# Altium schematic sheet 13-AM64x-02.SchDoc
size B; SheetNumber: 13; SheetTotal: 25
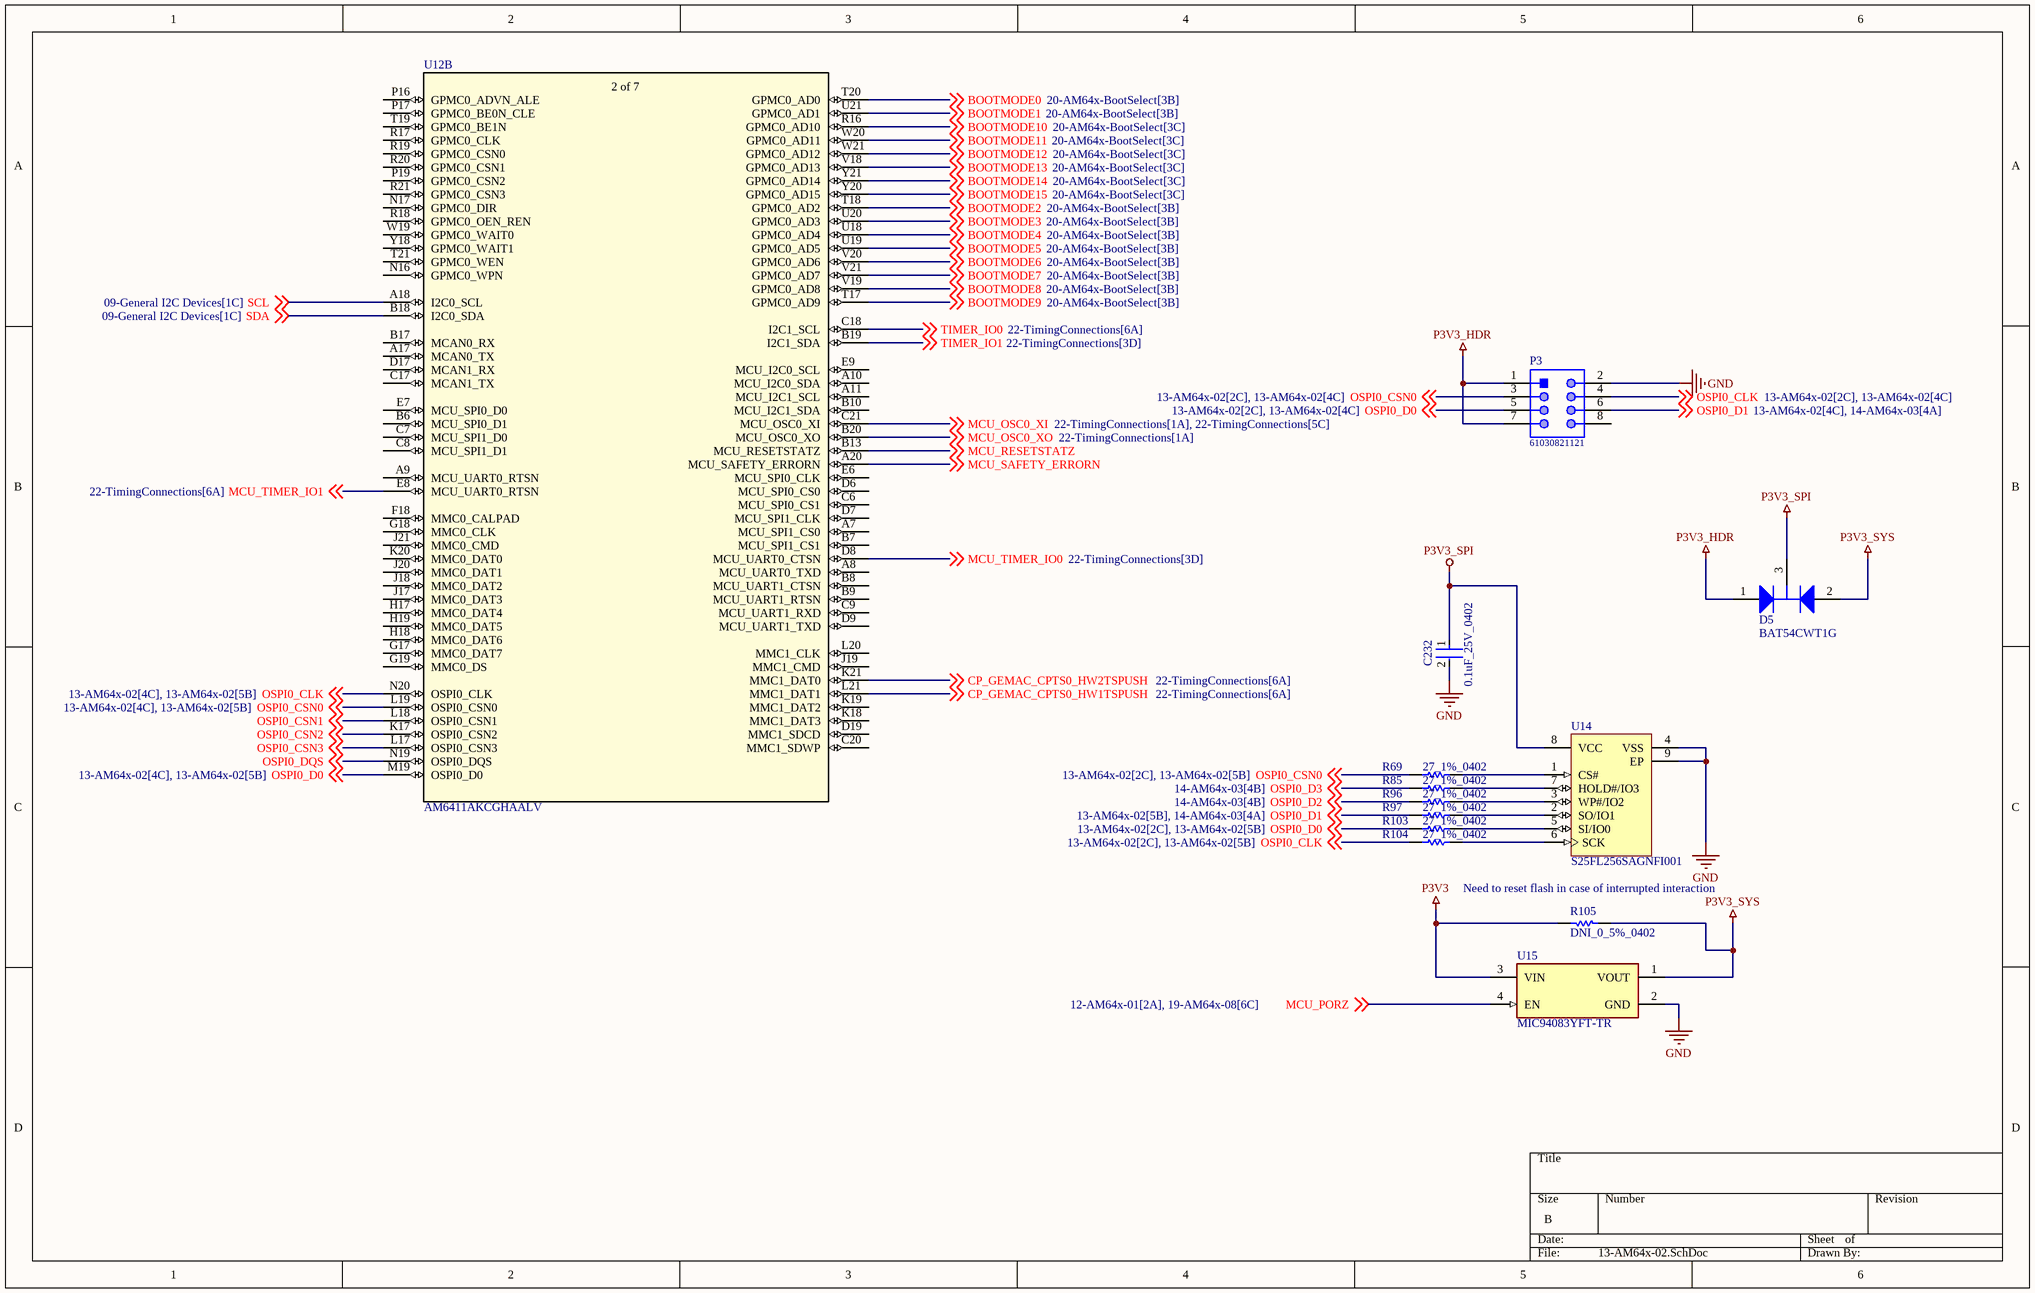
[diagram p0: 13-AM64x-02.SchDoc]

## Parts
C232  0.1uF_25V_0402  [FP-0402-L_1_0_1-W_0_5_0_1-IPC_C]
D5  BAT54CWT1G  [ONSC-SOT-323-3-419-04_V]
P3  61030821121  [61030821121]
R69  27_1%_0402  [RESC1005X40X25NL05T05]
R85  27_1%_0402  [RESC1005X40X25NL05T05]
R96  27_1%_0402  [RESC1005X40X25NL05T05]
R97  27_1%_0402  [RESC1005X40X25NL05T05]
R103  27_1%_0402  [RESC1005X40X25NL05T05]
R104  27_1%_0402  [RESC1005X40X25NL05T05]
R105  DNI_0_5%_0402  [RESC1005X40X25LL10T10]  (no BOM)
U12  AM6411AKCGHAALV  [FCBGA441_ALV_TEX]  (part B of 7)
U14  S25FL256SAGNFI001  [CYP-WSON-8_L]
U15  MIC94083YFT-TR  [FP-FTDFN085085-4LD-PL-1-MFG]

## Nets
GND: C232.2 P3.2 U14.4(VSS) U14.9(EP) U15.2(GND)
P3V3: R105.1 U15.3(VIN)
P3V3_HDR: D5.1(A1) P3.1 P3.7
P3V3_SPI: C232.1 D5.3(K) U14.8(VCC)
P3V3_SYS: D5.2(A2) R105.2 U15.1(VOUT)
BOOTMODE0: U12.T20(GPMC0_AD0) ; off-sheet BOOTMODE0
BOOTMODE1: U12.U21(GPMC0_AD1) ; off-sheet BOOTMODE1
BOOTMODE2: U12.T18(GPMC0_AD2) ; off-sheet BOOTMODE2
BOOTMODE3: U12.U20(GPMC0_AD3) ; off-sheet BOOTMODE3
BOOTMODE4: U12.U18(GPMC0_AD4) ; off-sheet BOOTMODE4
BOOTMODE5: U12.U19(GPMC0_AD5) ; off-sheet BOOTMODE5
BOOTMODE6: U12.V20(GPMC0_AD6) ; off-sheet BOOTMODE6
BOOTMODE7: U12.V21(GPMC0_AD7) ; off-sheet BOOTMODE7
BOOTMODE8: U12.V19(GPMC0_AD8) ; off-sheet BOOTMODE8
BOOTMODE9: U12.T17(GPMC0_AD9) ; off-sheet BOOTMODE9
BOOTMODE10: U12.R16(GPMC0_AD10) ; off-sheet BOOTMODE10
BOOTMODE11: U12.W20(GPMC0_AD11) ; off-sheet BOOTMODE11
BOOTMODE12: U12.W21(GPMC0_AD12) ; off-sheet BOOTMODE12
BOOTMODE13: U12.V18(GPMC0_AD13) ; off-sheet BOOTMODE13
BOOTMODE14: U12.Y21(GPMC0_AD14) ; off-sheet BOOTMODE14
BOOTMODE15: U12.Y20(GPMC0_AD15) ; off-sheet BOOTMODE15
CP_GEMAC_CPTS0_HW1TSPUSH: U12.L21(MMC1_DAT1) ; off-sheet CP_GEMAC_CPTS0_HW1TSPUSH
CP_GEMAC_CPTS0_HW2TSPUSH: U12.K21(MMC1_DAT0) ; off-sheet CP_GEMAC_CPTS0_HW2TSPUSH
MCU_OSC0_XI: U12.C21(MCU_OSC0_XI) ; off-sheet MCU_OSC0_XI
MCU_OSC0_XO: U12.B20(MCU_OSC0_XO) ; off-sheet MCU_OSC0_XO
MCU_PORZ: U15.4(EN) ; off-sheet MCU_PORZ
MCU_RESETSTATZ: U12.B13(MCU_RESETSTATZ) ; off-sheet MCU_RESETSTATZ
MCU_SAFETY_ERRORN: U12.A20(MCU_SAFETY_ERRORN) ; off-sheet MCU_SAFETY_ERRORN
MCU_TIMER_IO0: U12.D8(MCU_UART0_CTSN) ; off-sheet MCU_TIMER_IO0
MCU_TIMER_IO1: U12.E8(MCU_UART0_RTSN) ; off-sheet MCU_TIMER_IO1
OSPI0_CLK: P3.4 R104.1 U12.N20(OSPI0_CLK) ; off-sheet OSPI0_CLK
OSPI0_CSN0: P3.3 R69.1 U12.L19(OSPI0_CSN0) ; off-sheet OSPI0_CSN0
OSPI0_CSN1: U12.L18(OSPI0_CSN1) ; off-sheet OSPI0_CSN1
OSPI0_CSN2: U12.K17(OSPI0_CSN2) ; off-sheet OSPI0_CSN2
OSPI0_CSN3: U12.L17(OSPI0_CSN3) ; off-sheet OSPI0_CSN3
OSPI0_D0: P3.5 R103.1 U12.M19(OSPI0_D0) ; off-sheet OSPI0_D0
OSPI0_D1: P3.6 R97.1 ; off-sheet OSPI0_D1
OSPI0_D2: R96.1 ; off-sheet OSPI0_D2
OSPI0_D3: R85.1 ; off-sheet OSPI0_D3
OSPI0_DQS: U12.N19(OSPI0_DQS) ; off-sheet OSPI0_DQS
SCL: U12.A18(I2C0_SCL) ; off-sheet SCL
SDA: U12.B18(I2C0_SDA) ; off-sheet SDA
TIMER_IO0: U12.C18(I2C1_SCL) ; off-sheet TIMER_IO0
TIMER_IO1: U12.B19(I2C1_SDA) ; off-sheet TIMER_IO1
NetR69_2: R69.2 U14.1(CS#)
NetR85_2: R85.2 U14.7(HOLD#/IO3)
NetR96_2: R96.2 U14.3(WP#/IO2)
NetR97_2: R97.2 U14.2(SO/IO1)
NetR103_2: R103.2 U14.5(SI/IO0)
NetR104_2: R104.2 U14.6(SCK)

Not connected (* = marked no-connect by the designer): P3 8; U12 A7(MCU_SPI1_CS0) A8(MCU_UART0_TXD) A9(MCU_UART0_RTSN) A10(MCU_I2C0_SDA) A11(MCU_I2C1_SCL) A17(MCAN0_TX) B6(MCU_SPI0_D1) B7(MCU_SPI1_CS1) B8(MCU_UART1_CTSN) B9(MCU_UART1_RTSN) B10(MCU_I2C1_SDA) B17(MCAN0_RX) C6(MCU_SPI0_CS1) C7(MCU_SPI1_D0) C8(MCU_SPI1_D1) C9(MCU_UART1_RXD) C17(MCAN1_TX) C20(MMC1_SDWP) D6(MCU_SPI0_CS0) D7(MCU_SPI1_CLK) D9(MCU_UART1_TXD) D17(MCAN1_RX) D19(MMC1_SDCD) E6(MCU_SPI0_CLK) E7(MCU_SPI0_D0) E9(MCU_I2C0_SCL) F18(MMC0_CALPAD) G17(MMC0_DAT7) G18(MMC0_CLK) G19(MMC0_DS) H17(MMC0_DAT4) H18(MMC0_DAT6) H19(MMC0_DAT5) J17(MMC0_DAT3) J18(MMC0_DAT2) J19(MMC1_CMD) J20(MMC0_DAT1) J21(MMC0_CMD) K18(MMC1_DAT3) K19(MMC1_DAT2) K20(MMC0_DAT0) L20(MMC1_CLK) N16(GPMC0_WPN) N17(GPMC0_DIR) P16(GPMC0_ADVN_ALE) P17(GPMC0_BE0N_CLE) P19(GPMC0_CSN2) R17(GPMC0_CLK) R18(GPMC0_OEN_REN) R19(GPMC0_CSN0) R20(GPMC0_CSN1) R21(GPMC0_CSN3) T19(GPMC0_BE1N) T21(GPMC0_WEN) W19(GPMC0_WAIT0) Y18(GPMC0_WAIT1)

## Notes on the sheet
- Need to reset flash in case of interrupted interaction
- (in symbol AM6411AKCGHAALV, part B) 2 of 7

## Library data of the parts
C232 = CMP-2008-02519-2: General Purpose Ceramic Capacitor, 0402, 100nF, 10%, X7R, 15%, 25V; Package Quantity: 1; Capacitance: 100nF; Min Operating Temperature: -55°C; Voltage: 25V; Voltage Rating: 25V; Construction: Flat; Max Operating Temperature: 125°C; Radiation Hardening: No; Depth: 0.5mm; Thickness: 0.022inch; Voltage Rating (DC): 25V; Number of Pins: 2; Lead Free: Lead Free; Series: -; REACH SVHC: No SVHC; Length: 1mm; Dielectric: X7R; RoHS Compliant: Yes; Mount: Surface Mount; Packaging: Tape and Reel; Case/Package: 0402; Case Code (Imperial): 0402; Termination: SMD/SMT; Width: 0.02inch; Case Code (Metric): 1005; Tolerance: 10%
D5 = CMP-1055-00557-1: Dual Series Cathode Schottky Barrier Diodes, 3-Pin SOT-323, Pb-Free, Tape and Reel; Manufacturer: On Semiconductor; Configuration: Common Cathode; IFSM Max (A): 0.6; trr Max (ns): 5; ComponentLink2Description: Datasheet; Packing: Tape and Reel; ComponentLink3Description: Package Specification; Mounting Technology: Surface Mount; PartNumber: BAT54CWT1G; PackageVersion: Rev. N, 11/2008; RoHS: TRUE; ComponentLink3URL: http://www.onsemi.com/pub_link/Collateral/419-04.PDF; ComponentLink2URL: http://www.onsemi.cn/pub_link/Collateral/BAT54CWT1-D.PDF; PackageReference: SOT-323-3-419-04; ComponentLink1URL: http://www.onsemi.com/; ComponentLink1Description: Manufacturer URL; DatasheetVersion: Rev. 7; PackageDescription: 3-Pin Small Outline Transistor, Body 2 x 1.25 mm, Pitch 0.65 mm
P3 = CMP-1502-01052-1: SMT Vertical Pin Header WR-PHD, Pitch 2.54 mm, Dual Row, 8 pins; Manufacturer: Wurth Elektronik; Pitch: 2.54mm; Withstanding Voltage: 500VAC; Contact Resistance: 20mOhm; Pin Number: 8; Working Voltage: 250VAC; Rated Current: 3A; Gender: Male; Publisher: WurthElektronik; Orientation: Vertical; Manufacturer URL: http://www.we-online.de; Packaging: TapeandReel; Package Reference: 61030821121; Mounting Technology: SMT; Part Number: 61030821121; Datasheet URL: https://katalog.we-online.de/em/datasheet/6103xx21121.pdf; Row Number: Dual; Operating Temperature: -40to125degC
R69 R85 R96 R97 R103 R104 = CMP-2002-08434-1: Part Number: CRCW040227R0FKED; Manufacturer: Vishay Dale
R105 = CMP-2002-04569-1: Manufacturer: KOA Speer; Part Number: RK73Z1ETTP
U12 = AM6411AKCGHAALV: No Description Available; Mfr_Name: Texas Instruments; RefDes: RefDes; Type: Type
U14 = CMP-2000-07017-1: SPI Flash Memory, 2.7 to 3.6 V, -40 to 85 degC, 8-Pin WSON, RoHS, Tube; Manufacturer: CypressSemiconductorCorp; Interface: SPISerial; Voltage - Supply: 2.7V~3.6V; Memory Type: FLASH-NOR; Speed: 133MHz; Memory Size: 256M(32Mx8); Supplier Device Package: 8-WSON(6x8); Operating Temperature: -40°C~85°C(TA); Package Description: 8-Pin Small Outline No-lead Package, Body 6 x 8 mm, Pitch 1.27 mm; Series: FL-S; Datasheet Version: Rev. *I, 08/2015; Package Reference: WSON-8; Datasheet URL: http://www.spansion.com/Support/Datasheets/S25FL128S_256S_00.pdf; Packaging: Tube; Manufacturer URL: http://www.cypress.com/; Package / Case: 8-WDFNExposedPad; Format - Memory: FLASH; Family: Memory; Mounting Technology: SurfaceMount; Category: IntegratedCircuits(ICs)
U15 = CMP-06317-000053-1: IC PWR SWITCH P-CHAN 1:1 4TMLF; Turn-On Delay Time: 1.5us; Turn-Off Delay Time: 200ns; On-State Resistance: 67mR; Output Current: 2A; Min Supply Voltage: 1.7V; Number of Outputs: 1; Interface: On/Off; Output Configuration: High Side; Max Supply Voltage: 5.5V; Radiation Hardening: No; Min Operating Temperature: -40°C; Mount: Surface Mount; Series: -; RoHS Compliant: Yes; Number of Pins: 4; Reach SVHC Compliant: Yes; On-state Resistance-Max: 67MR; Package Quantity: 5000; Packaging: Tape and Reel; Max Output Current: 2A; Supply Current: 2A; Lead Free: Lead Free; Current Rating: 2A; Max Operating Temperature: 125°C; Rated Current-Max: 2A; Nominal Supply Current: 2A